# Altium schematic sheet BLUENRG-345_REV1_Sheet2.SchDoc: = Title
size A3; Author: FELIPE; DocumentNumber: 2; SheetNumber: 2; SheetTotal: 3; DocumentName: Sheet2.SCHDOC
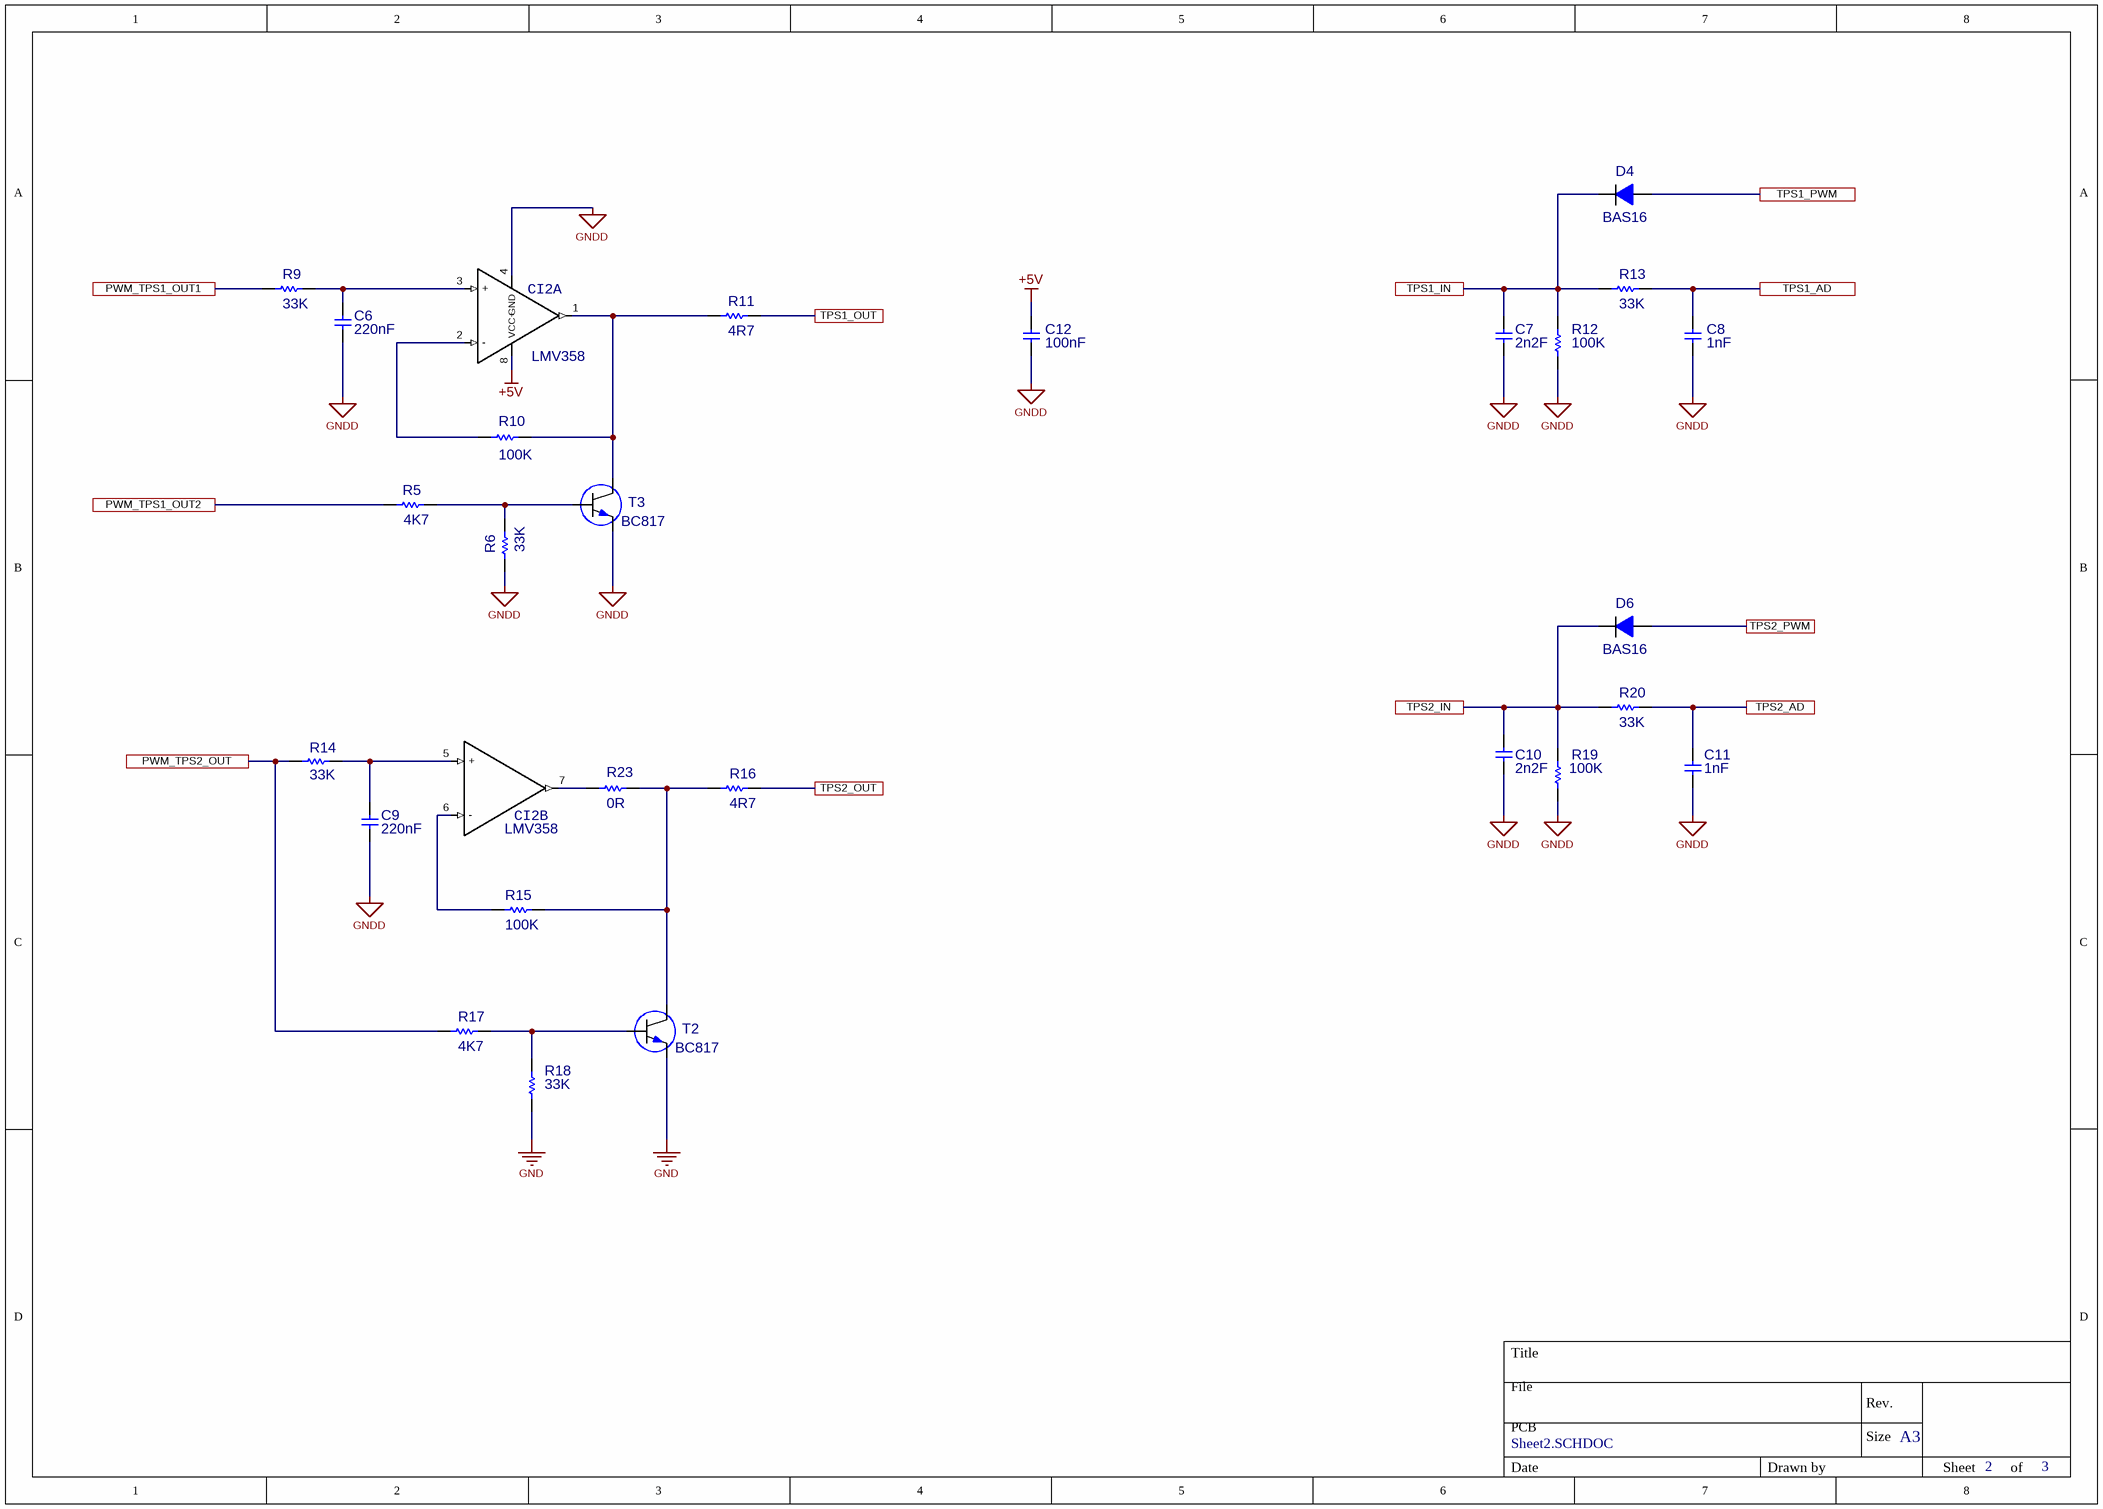
[diagram p0: BLUENRG-345_REV1_Sheet2.SchDoc]

## Parts
C6  value 220nF  [C0402_REV1]  (hidden comment: C0402)
C7  value 2n2F  [C0402_REV1]  (hidden comment: C0402)
C8  value 1nF  [C0402_REV1]  (hidden comment: C0402)
C9  value 220nF  [C0402_REV1]  (hidden comment: C0402)
C10  value 2n2F  [C0402_REV1]  (hidden comment: C0402)
C11  value 1nF  [C0402_REV1]  (hidden comment: C0402)
C12  value 100nF  [C0402_REV1]  (hidden comment: C0402)
CI2  value LMV358  [TSSOP-8_REV1 - MINISO8]  (hidden comment: CI_LMV358_TSSOP8)  (parts A,B of 2)
D4  value BAS16  [SOD323_IPC]  (hidden comment: D_BAS16_SOD323)
D6  value BAS16  [SOD323_IPC]  (hidden comment: D_BAS16_SOD323)
R5  value 4K7  [R0402_REV1]  (hidden comment: RES 0402 4K7 1/16W 5%)
R6  value 33K  [R0402_REV1]  (hidden comment: R0603)
R9  value 33K  [R0402_REV1]  (hidden comment: R0603)
R10  value 100K  [R0402_REV1]  (hidden comment: R0402)
R11  value 4R7  [R0402_REV1]  (hidden comment: RES 0402 4R7 1/16W 5%)
R12  value 100K  [R0402_REV1]  (hidden comment: R0402)
R13  value 33K  [R0402_REV1]  (hidden comment: R0603)
R14  value 33K  [R0402_REV1]  (hidden comment: R0603)
R15  value 100K  [R0402_REV1]  (hidden comment: R0402)
R16  value 4R7  [R0402_REV1]  (hidden comment: RES 0402 4R7 1/16W 5%)
R17  value 4K7  [R0402_REV1]  (hidden comment: RES 0402 4K7 1/16W 5%)
R18  value 33K  [R0402_REV1]  (hidden comment: R0603)
R19  value 100K  [R0402_REV1]  (hidden comment: R0402)
R20  value 33K  [R0402_REV1]  (hidden comment: R0603)
R23  value 0R  [R0402_REV1]  (hidden comment: RES 0402 0R 1/16W 5%)
T2  BC817  [SOT23_REV1]
T3  BC817  [SOT23_REV1]

## Ports
PWM_TPS1_OUT1, PWM_TPS1_OUT2, PWM_TPS2_OUT, TPS1_AD, TPS1_IN, TPS1_OUT, TPS1_PWM, TPS2_AD, TPS2_IN, TPS2_OUT, TPS2_PWM

## Nets
+5V: C12.2(-) CI2.8(VCC+)
GND: R18.1 T2.2(E)
GNDD: C6.1 C7.2 C8.2 C9.1 C10.2 C11.2 C12.1(+) CI2.4(GND) R6.1 R12.1 R19.1 T3.2(E)
PWM_TPS1_OUT1: R9.1 ; port PWM_TPS1_OUT1
PWM_TPS1_OUT2: R5.1 ; port PWM_TPS1_OUT2
PWM_TPS2_OUT: R14.1 R17.1 ; port PWM_TPS2_OUT
TPS1_AD: C8.1 R13.2 ; port TPS1_AD
TPS1_IN: C7.1 D4.2(K) R12.2 R13.1 ; port TPS1_IN
TPS1_OUT: R11.2 ; port TPS1_OUT
TPS1_PWM: D4.1(A) ; port TPS1_PWM
TPS2_AD: C11.1 R20.2 ; port TPS2_AD
TPS2_IN: C10.1 D6.2(K) R19.2 R20.1 ; port TPS2_IN
TPS2_OUT: R16.2 ; port TPS2_OUT
TPS2_PWM: D6.1(A) ; port TPS2_PWM
NetC6_2: C6.2 CI2.3(+) R9.2
NetC9_2: C9.2 CI2.5(+) R14.2
NetCI2_1: CI2.1(OUT) R10.2 R11.1 T3.3(C)
NetCI2_2: CI2.2(-) R10.1
NetCI2_6: CI2.6(-) R15.1
NetCI2_7: CI2.7(OUT) R23.1
NetR5_2: R5.2 R6.2 T3.1(B)
NetR15_2: R15.2 R16.1 R23.2 T2.3(C)
NetR17_2: R17.2 R18.2 T2.1(B)

## Notes on the sheet
- Title
- File
- PCB
- Rev.
- Size
- A3
- Date
- Drawn by
- Sheet
- of

## Library data of the parts
C6 C9 = CAP_0402 220nF 10% 16V X7R: CAPACITOR 0402 220NF / 16V X7R 10%; Partnumber Fabricante 01: GRM155R71H224KA12D; Código Tury: 002.00.00014; Tipo de Montagem: SMD; Fabricante 01: MURATA; Fabricante 02: YAGEO; Fabricante 03: TAIYO-YUDEN; Partnumber Fabricante 02: CC0402KRX7R8BB224; Partnumber Fabricante 03: UMK105BJ224KV-F
C7 C10 = CAP_0402 2n2F 5% 50V X7R: CAPACITOR 0402 2n2F / 50V C0G 5%; Tipo de Montagem: SMD; Código Tury: 002.00.00017
C8 C11 = CAP_0402 1nF 5% 50V X7R: CAPACITOR 0402 1NF / 50V C0G 5%; Partnumber Fabricante 01: GRT1555C1H102JA02D; Tipo de Montagem: SMD; Código Tury: 002.00.00004; Fabricante 01: MURATA; Fabricante 02: SAMSUNGEM; Fabricante 03: YAGEO; Partnumber Fabricante 02: CL05B102KB5NNNC; Partnumber Fabricante 03: CC0402JRNP09BN102
C12 = CAP_0402 100nF 10% 50V X7R: CAPACITOR 0402 100NF / 50V X7R 10%; Partnumber Fabricante 01: GCM155R71H104KE02D; Código Tury: 002.00.00015; Tipo de Montagem: SMD; Fabricante 01: MURATA; Fabricante 02: YAGEO; Partnumber Fabricante 02: CC0402KRX5R9BB104
CI2 = CI_LMV358_TSSOP8: CI AMPLIFICADOR OPERACIONAL LMV358IPT TSSOP8; Tipo de Montagem: SMD; Código Tury: 004.00.00011; Fabricante 01: ST; Encapsulamento: TSSOP8; Partnumber Fabricante 01: LMV358IPT
D4 D6 = D_BAS16_SOD323: DIODO DE SINAL BAS16 SOD323; Partnumber Fabricante 01: BAS316; Código Tury: 005.00.00010; Tipo de Montagem: SMD; Fabricante 01: NXP; Fabricante 02: ON; Fabricante 03: VISHAY; Partnumber Fabricante 02: BAS16HT1G; Partnumber Fabricante 03: BAS16WS
R5 R17 = RES 0402 4K7 1/16W 5%: RESISTOR 0402 4K7 1/16W 5%; Partnumber Fabricante 01: CRCW04024K70JNED; Código Tury: 001.00.00009; Encapsulamento: 0402; Tipo de Montagem: SMD; Fabricante 02: VIKING; Fabricante 01: VISHAY; Fabricante 03: WALSIN; Partnumber Fabricante 02: CR-02JL6---4K7; Partnumber Fabricante 03: WR04X472JTL
R6 R9 R14 R18 = RES 0402 33K 1/16W 5%: RESISTOR 0402 33K 1/16W 5%; Partnumber Fabricante 01: CRCW040233K0JNEDC; Código Tury: 001.00.00023; Encapsulamento: 0402; Tipo de Montagem: SMD; Fabricante 01: VISHAY
R10 R15 = RES 0402 100K 1/16W 5%: RESISTOR 0402 100K 1/16W 5%; Partnumber Fabricante 01: CRCW0402100KJNED; Encapsulamento: 0402; Tipo de Montagem: SMD; Código Tury: 001.00.00005; Fabricante 01: VISHAY; Fabricante 02: VIKING; Fabricante 03: WALSIN; Partnumber Fabricante 02: CR-02JL6--100K; Partnumber Fabricante 03: WR04X104JTL
R11 R16 = RES 0402 4R7 1/16W 5%: RESISTOR 0402 4R7 1/16W 5%; Partnumber Fabricante 01: CRCW04024R70JNED; Código Tury: 001.00.00011; Encapsulamento: 0402; Tipo de Montagem: SMD; Fabricante 01: VISHAY; Fabricante 02: VIKING; Fabricante 03: FENGHUA; Partnumber Fabricante 02: CR-02JL6--4R7; Partnumber Fabricante 03: RC-02U4R7JT
R12 R19 = RES 0402 100K 1/16W 5%: RESISTOR 0402 100K 1/16W 5%; Partnumber Fabricante 01: CRCW0402100KJNED; Código Tury: 001.00.00005; Encapsulamento: 0402; Tipo de Montagem: SMD; Fabricante 01: VISHAY; Fabricante 02: VIKING; Fabricante 03: WALSIN; Partnumber Fabricante 02: CR-02JL6--100K; Partnumber Fabricante 03: WR04X104JTL
R13 R20 = RES 0402 33K 1/16W 5%: RESISTOR 0402 33K 1/16W 5%; Partnumber Fabricante 01: CRCW040233K0JNEDC; Encapsulamento: 0402; Tipo de Montagem: SMD; Código Tury: 001.00.00023; Fabricante 01: VISHAY
R23 = RES 0402 0R 1/16W 5%: RESISTOR 0402 0R 1/16W 5%; Partnumber Fabricante 01: RC0402JR-070RL; Código Tury: 001.00.00024; Encapsulamento: 0402; Tipo de Montagem: SMD; Fabricante 01: YAGEO; Fabricante 02: WALSIN; Partnumber Fabricante 02: MR04X000PTL
T2 T3 = T_BC817_SOT23: TRANSISTOR BIPOLAR DE SINAL BC817/40  SOT23; Partnumber Fabricante 01: BC817-40LT1G; Código Tury: 006.00.00004; Tipo de Montagem: SMD; Fabricante 01: ON; Fabricante 02: NXP; Value: BC817; Encapsulamento: SOT23; Partnumber Fabricante 02: BC817-40,215